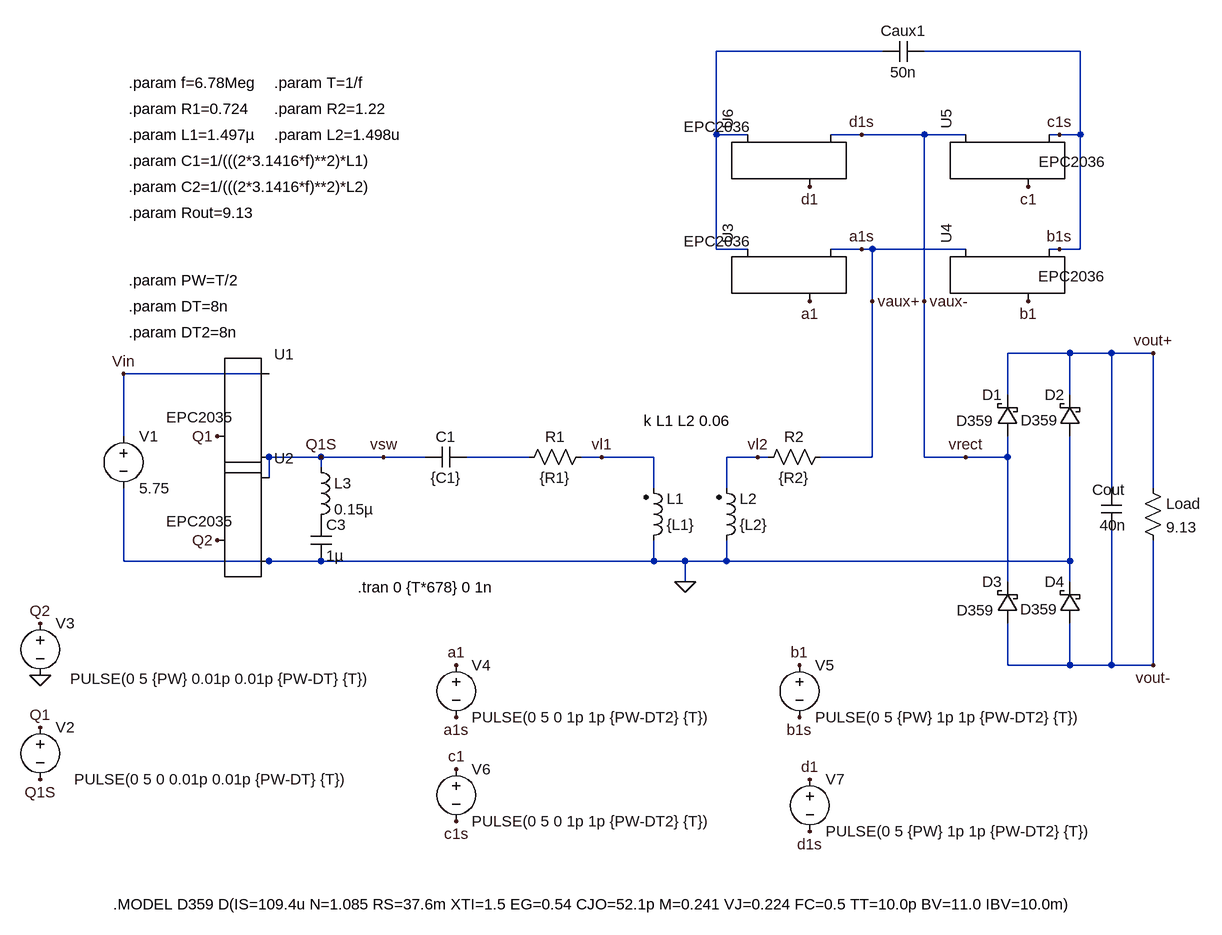
[diagram p0: schematic DBS.asc]
DBS.asc, the LTspice schematic file:
Version 4
SHEET 1 2368 1432
WIRE -336 -128 -592 -128
WIRE -32 -128 -272 -128
WIRE -592 0 -592 -128
WIRE -544 0 -592 0
WIRE -368 0 -416 0
WIRE -272 0 -368 0
WIRE -208 0 -272 0
WIRE -64 0 -80 0
WIRE -32 0 -32 -128
WIRE -32 0 -64 0
WIRE -592 176 -592 0
WIRE -544 176 -592 176
WIRE -368 176 -416 176
WIRE -352 176 -368 176
WIRE -208 176 -352 176
WIRE -64 176 -80 176
WIRE -32 176 -32 0
WIRE -32 176 -64 176
WIRE -352 256 -352 176
WIRE -272 256 -272 0
WIRE -48 336 -144 336
WIRE 16 336 -48 336
WIRE 80 336 16 336
WIRE -1280 368 -1504 368
WIRE -144 400 -144 336
WIRE -48 400 -48 336
WIRE -1504 464 -1504 368
WIRE -1200 496 -1280 496
WIRE -1104 496 -1200 496
WIRE -1040 496 -1104 496
WIRE -880 496 -976 496
WIRE -768 496 -800 496
WIRE -688 496 -768 496
WIRE -528 496 -576 496
WIRE -512 496 -528 496
WIRE -352 496 -352 256
WIRE -352 496 -432 496
WIRE -272 496 -272 256
WIRE -208 496 -272 496
WIRE -144 496 -144 464
WIRE -144 496 -208 496
WIRE -1200 512 -1200 496
WIRE -1280 528 -1280 496
WIRE -688 544 -688 496
WIRE -576 544 -576 496
WIRE 16 544 16 336
WIRE 80 544 80 336
WIRE -1504 656 -1504 544
WIRE -1280 656 -1504 656
WIRE -1200 656 -1280 656
WIRE -688 656 -688 624
WIRE -688 656 -1200 656
WIRE -640 656 -688 656
WIRE -576 656 -576 624
WIRE -576 656 -640 656
WIRE -48 656 -48 464
WIRE -48 656 -576 656
WIRE -640 688 -640 656
WIRE -144 688 -144 496
WIRE -48 688 -48 656
WIRE -144 816 -144 752
WIRE -48 816 -48 752
WIRE -48 816 -144 816
WIRE 16 816 16 608
WIRE 16 816 -48 816
WIRE 80 816 80 624
WIRE 80 816 16 816
FLAG -640 688 0
FLAG -768 496 vl1
FLAG -528 496 vl2
FLAG -1360 464 Q1
FLAG -1360 624 Q2
FLAG -1632 832 0
FLAG -1200 496 Q1S
FLAG -1632 992 Q1S
FLAG -1504 368 Vin
FLAG -1632 912 Q1
FLAG -1632 752 Q2
FLAG -1104 496 vsw
FLAG 80 336 vout+
FLAG 80 816 vout-
FLAG -208 496 vrect
FLAG -448 256 a1
FLAG -112 80 c1
FLAG -112 256 b1
FLAG -448 80 d1
FLAG -272 256 vaux-
FLAG -368 176 a1s
FLAG -368 0 d1s
FLAG -64 176 b1s
FLAG -64 0 c1s
FLAG -352 256 vaux+
FLAG -992 816 a1
FLAG -464 816 b1
FLAG -992 896 a1s
FLAG -464 896 b1s
FLAG -992 976 c1
FLAG -448 992 d1
FLAG -992 1056 c1s
FLAG -448 1072 d1s
SYMBOL cap -976 480 R90
WINDOW 0 0 32 VBottom 2
WINDOW 3 32 32 VTop 2
SYMATTR InstName C1
SYMATTR Value {C1}
SYMBOL ind2 -704 640 M180
WINDOW 0 36 80 Left 2
WINDOW 3 36 40 Left 2
SYMATTR InstName L1
SYMATTR Value {L1}
SYMATTR Type ind
SYMBOL ind2 -592 640 M180
WINDOW 0 36 80 Left 2
WINDOW 3 36 40 Left 2
SYMATTR InstName L2
SYMATTR Value {L2}
SYMATTR Type ind
SYMBOL res -784 480 R90
WINDOW 0 0 56 VBottom 2
WINDOW 3 32 56 VTop 2
SYMATTR InstName R1
SYMATTR Value {R1}
SYMBOL res -416 480 R90
WINDOW 0 0 56 VBottom 2
WINDOW 3 32 56 VTop 2
SYMATTR InstName R2
SYMATTR Value {R2}
SYMBOL voltage -1632 896 R0
WINDOW 123 0 0 Left 0
WINDOW 39 0 0 Left 0
WINDOW 3 52 96 Left 2
SYMATTR Value PULSE(0 5 0 0.01p 0.01p {PW-DT} {T})
SYMATTR InstName V2
SYMBOL EPCGaN -1360 464 R0
WINDOW 3 -78 -29 Left 2
SYMATTR Value EPC2035
SYMATTR InstName U1
SYMBOL EPCGaN -1360 624 R0
WINDOW 3 -78 -29 Left 2
SYMATTR Value EPC2035
SYMATTR InstName U2
SYMBOL voltage -1504 448 R0
WINDOW 123 0 0 Left 0
WINDOW 39 0 0 Left 0
SYMATTR InstName V1
SYMATTR Value 5.75
SYMBOL voltage -1632 736 R0
WINDOW 123 0 0 Left 0
WINDOW 39 0 0 Left 0
WINDOW 3 46 101 Left 2
SYMATTR Value PULSE(0 5 {PW} 0.01p 0.01p {PW-DT} {T})
SYMATTR InstName V3
SYMBOL cap -1216 592 R0
SYMATTR InstName C3
SYMATTR Value 1µ
SYMBOL ind -1216 496 R0
SYMATTR InstName L3
SYMATTR Value 0.15µ
SYMBOL res 64 528 R0
SYMATTR InstName Load
SYMATTR Value 9.13
SYMBOL cap 0 544 R0
WINDOW 0 -14 2 Left 2
WINDOW 3 -2 57 Left 2
SYMATTR InstName Cout
SYMATTR Value 40n
SYMBOL schottky -128 464 R180
WINDOW 0 24 64 Left 2
WINDOW 3 37 24 Left 2
SYMATTR InstName D1
SYMATTR Value D359
SYMBOL schottky -32 464 R180
WINDOW 0 24 64 Left 2
WINDOW 3 34 25 Left 2
SYMATTR InstName D2
SYMATTR Value D359
SYMBOL schottky -128 752 R180
WINDOW 0 24 64 Left 2
WINDOW 3 36 20 Left 2
SYMATTR InstName D3
SYMATTR Value D359
SYMBOL schottky -32 752 R180
WINDOW 0 24 64 Left 2
WINDOW 3 35 22 Left 2
SYMATTR InstName D4
SYMATTR Value D359
SYMBOL cap -272 -144 R90
WINDOW 0 0 32 VBottom 2
WINDOW 3 32 32 VTop 2
SYMATTR InstName Caux1
SYMATTR Value 50n
SYMBOL EPCGaN -448 256 R270
WINDOW 3 92 -194 VRight 2
SYMATTR Value EPC2036
SYMATTR InstName U3
SYMBOL EPCGaN -112 256 R270
WINDOW 3 38 15 VRight 2
SYMATTR Value EPC2036
SYMATTR InstName U4
SYMBOL EPCGaN -112 80 R270
WINDOW 3 38 16 VRight 2
SYMATTR Value EPC2036
SYMATTR InstName U5
SYMBOL EPCGaN -448 80 R270
WINDOW 3 92 -194 VRight 2
SYMATTR Value EPC2036
SYMATTR InstName U6
SYMBOL voltage -992 800 R0
WINDOW 123 0 0 Left 0
WINDOW 39 24 124 Left 2
SYMATTR InstName V4
SYMATTR Value PULSE(0 5 0 1p 1p {PW-DT2} {T})
SYMBOL voltage -464 800 R0
WINDOW 123 0 0 Left 0
WINDOW 39 24 124 Left 2
SYMATTR InstName V5
SYMATTR Value PULSE(0 5 {PW} 1p 1p {PW-DT2} {T})
SYMBOL voltage -992 960 R0
WINDOW 123 0 0 Left 0
WINDOW 39 24 124 Left 2
SYMATTR InstName V6
SYMATTR Value PULSE(0 5 0 1p 1p {PW-DT2} {T})
SYMBOL voltage -448 976 R0
WINDOW 123 0 0 Left 0
WINDOW 39 24 124 Left 2
SYMATTR InstName V7
SYMATTR Value PULSE(0 5 {PW} 1p 1p {PW-DT2} {T})
TEXT -704 440 Left 2 !k L1 L2 0.06
TEXT -1144 696 Left 2 !.tran 0 {T*678} 0 1n
TEXT -1496 224 Left 2 !.param PW=T/2
TEXT -1496 264 Left 2 !.param DT=8n
TEXT -1496 0 Left 2 !.param L1=1.497µ
TEXT -1496 -40 Left 2 !.param R1=0.724
TEXT -1496 40 Left 2 !.param C1=1/(((2*3.1416*f)**2)*L1)
TEXT -1496 -80 Left 2 !.param f=6.78Meg
TEXT -1272 -80 Left 2 !.param T=1/f
TEXT -1272 -40 Left 2 !.param R2=1.22
TEXT -1272 0 Left 2 !.param L2=1.498u
TEXT -1496 80 Left 2 !.param C2=1/(((2*3.1416*f)**2)*L2)
TEXT -1496 120 Left 2 !.param Rout=9.13
TEXT -1520 1184 Left 2 !.MODEL D359 D(IS=109.4u N=1.085 RS=37.6m XTI=1.5 EG=0.54 CJO=52.1p M=0.241 VJ=0.224 FC=0.5 TT=10.0p BV=11.0 IBV=10.0m)
TEXT -1496 304 Left 2 !.param DT2=8n

The netlist it stands for:
* DBS.asc
C1 N002 vsw {C1}
L1 0 vl1 {L1}
L2 0 vl2 {L2}
R1 vl1 N002 {R1}
R2 vaux+ vl2 {R2}
V2 Q1 vsw PULSE(0 5 0 0.01p 0.01p {PW-DT} {T})
XU1 Q1 Vin vsw EPC2035
XU2 Q2 vsw 0 EPC2035
V1 Vin 0 5.75
V3 Q2 0 PULSE(0 5 {PW} 0.01p 0.01p {PW-DT} {T})
C3 P001 0 1µ
L3 vsw P001 0.15µ
R§Load vout+ vout- 9.13
Cout vout+ vout- 40n
D1 d1s vout+ D359
D2 0 vout+ D359
D3 vout- d1s D359
D4 vout- 0 D359
Caux1 c1s N001 50n
XU3 a1 N001 vaux+ EPC2036
XU4 b1 vaux+ c1s EPC2036
XU5 c1 d1s c1s EPC2036
XU6 d1 N001 d1s EPC2036
V4 a1 vaux+ PULSE(0 5 0 1p 1p {PW-DT2} {T})
V5 b1 c1s PULSE(0 5 {PW} 1p 1p {PW-DT2} {T})
V6 c1 c1s PULSE(0 5 0 1p 1p {PW-DT2} {T})
V7 d1 d1s PULSE(0 5 {PW} 1p 1p {PW-DT2} {T})
.model D D
.lib standard.dio
k L1 L2 0.06
.tran 0 {T*678} 0 1n
.param PW=T/2
.param DT=8n
.param L1=1.497µ
.param R1=0.724
.param C1=1/(((2*3.1416*f)**2)*L1)
.param f=6.78Meg
.param T=1/f
.param R2=1.22
.param L2=1.498u
.param C2=1/(((2*3.1416*f)**2)*L2)
.param Rout=9.13
.MODEL D359 D(IS=109.4u N=1.085 RS=37.6m XTI=1.5 EG=0.54 CJO=52.1p M=0.241 VJ=0.224 FC=0.5 TT=10.0p BV=11.0 IBV=10.0m)
.param DT2=8n
.backanno
.end